# Altium schematic sheet My_STM32_BOARD_HEADER_SCH.SchDoc
size A4
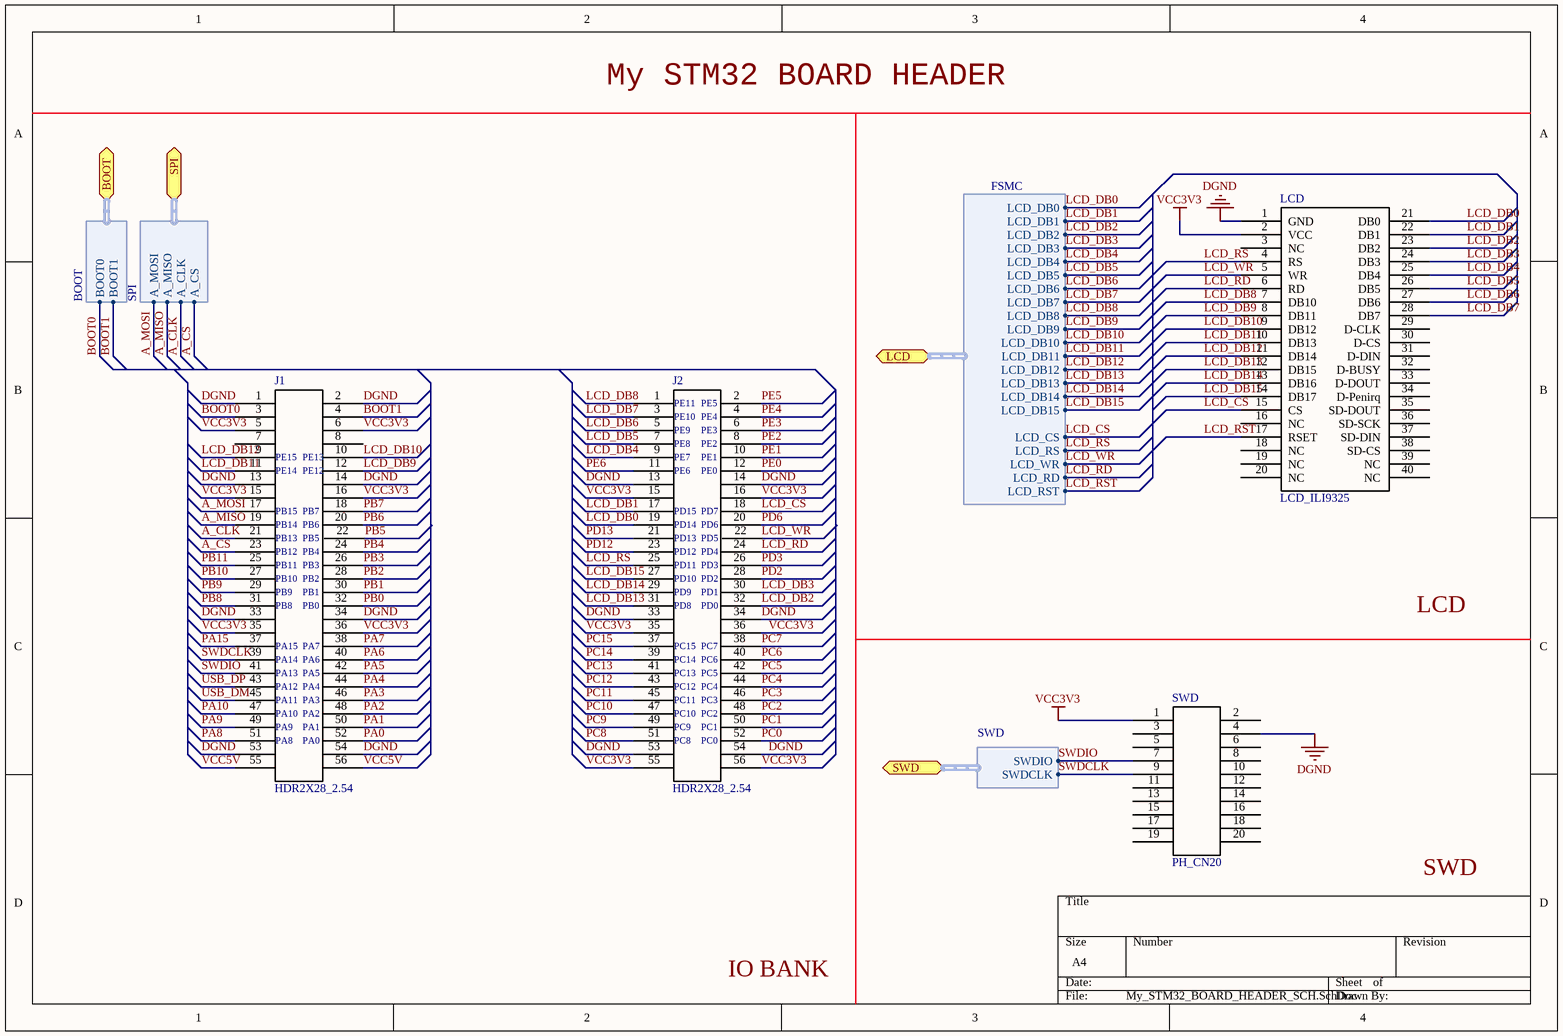
[diagram p0: My_STM32_BOARD_HEADER_SCH.SchDoc]

## Parts
J1  HDR2X28_2.54  [HDR2X28_2.54]
J2  HDR2X28_2.54  [HDR2X28_2.54]
LCD  LCD_ILI9325  [ILI9325]
SWD  PH_CN20  [CN20]

## Ports
BOOT (harness BOOT), LCD (harness FSMC), SPI (harness SPI), SWD (harness SWD)

## Harnesses
FSMC: LCD_RST, LCD_RD, LCD_WR, LCD_RS, LCD_CS, LCD_DB0, LCD_DB1, LCD_DB2, LCD_DB3, LCD_DB4, LCD_DB5, LCD_DB6, LCD_DB7, LCD_DB8, LCD_DB9, LCD_DB10, LCD_DB11, LCD_DB12, LCD_DB13, LCD_DB14, LCD_DB15
SWD: SWDIO, SWDCLK
BOOT: BOOT1, BOOT0
SPI: A_CLK, A_MISO, A_MOSI, A_CS

## Nets
DGND: J1.1 J1.2 J1.13 J1.14 J1.33 J1.34 J1.53 J1.54 J2.13 J2.14 J2.33 J2.34 J2.53 J2.54 LCD.1(GND) SWD.4
VCC3V3: J1.5 J1.6 J1.15 J1.16 J1.35 J1.36 J2.15 J2.16 J2.35 J2.36 J2.55 J2.56 LCD.2(VCC) SWD.1
A_CLK: J1.21 ; port SPI.A_CLK
A_CS: J1.23 ; port SPI.A_CS
A_MISO: J1.19 ; port SPI.A_MISO
A_MOSI: J1.17 ; port SPI.A_MOSI
BOOT0: J1.3 ; port BOOT.BOOT0
BOOT1: J1.4 ; port BOOT.BOOT1
LCD_CS: J2.18 LCD.15(CS) ; port LCD.LCD_CS
LCD_DB0: J2.19 LCD.21(DB0) ; port LCD.LCD_DB0
LCD_DB1: J2.17 LCD.22(DB1) ; port LCD.LCD_DB1
LCD_DB2: J2.32 LCD.23(DB2) ; port LCD.LCD_DB2
LCD_DB3: J2.30 LCD.24(DB3) ; port LCD.LCD_DB3
LCD_DB4: J2.9 LCD.25(DB4) ; port LCD.LCD_DB4
LCD_DB5: J2.7 LCD.26(DB5) ; port LCD.LCD_DB5
LCD_DB6: J2.5 LCD.27(DB6) ; port LCD.LCD_DB6
LCD_DB7: J2.3 LCD.28(DB7) ; port LCD.LCD_DB7
LCD_DB8: J2.1 LCD.7(DB10) ; port LCD.LCD_DB8
LCD_DB9: J1.12 LCD.8(DB11) ; port LCD.LCD_DB9
LCD_DB10: J1.10 LCD.9(DB12) ; port LCD.LCD_DB10
LCD_DB11: J1.11 LCD.10(DB13) ; port LCD.LCD_DB11
LCD_DB12: J1.9 LCD.11(DB14) ; port LCD.LCD_DB12
LCD_DB13: J2.31 LCD.12(DB15) ; port LCD.LCD_DB13
LCD_DB14: J2.29 LCD.13(DB16) ; port LCD.LCD_DB14
LCD_DB15: J2.27 LCD.14(DB17) ; port LCD.LCD_DB15
LCD_RD: J2.24 LCD.6(RD) ; port LCD.LCD_RD
LCD_RS: J2.25 LCD.4(RS) ; port LCD.LCD_RS
LCD_RST: LCD.17(RSET) ; port LCD.LCD_RST
LCD_WR: LCD.5(WR) ; port LCD.LCD_WR
PA0: J1.52
PA1: J1.50
PA2: J1.48
PA3: J1.46
PA4: J1.44
PA5: J1.42
PA6: J1.40
PA7: J1.38
PA8: J1.51
PA9: J1.49
PA10: J1.47
PA15: J1.37
PB0: J1.32
PB1: J1.30
PB2: J1.28
PB3: J1.26
PB4: J1.24
PB5: J1.22
PB6: J1.20
PB7: J1.18
PB8: J1.31
PB9: J1.29
PB10: J1.27
PB11: J1.25
PC0: J2.52
PC1: J2.50
PC2: J2.48
PC3: J2.46
PC4: J2.44
PC5: J2.42
PC6: J2.40
PC7: J2.38
PC8: J2.51
PC9: J2.49
PC10: J2.47
PC11: J2.45
PC12: J2.43
PC13: J2.41
PC14: J2.39
PC15: J2.37
PD2: J2.28
PD3: J2.26
PD6: J2.20
PD12: J2.23
PD13: J2.21
PE0: J2.12
PE1: J2.10
PE2: J2.8
PE3: J2.6
PE4: J2.4
PE5: J2.2
PE6: J2.11
SWDCLK: J1.39 SWD.9 ; port SWD.SWDCLK
SWDIO: J1.41 SWD.7 ; port SWD.SWDIO
USB_DM: J1.45
USB_DP: J1.43
VCC5V: J1.55 J1.56

Not connected (* = marked no-connect by the designer): J1 7 8; J2 22; LCD 3(NC) 16(NC) 18(NC) 19(NC) 20(NC) 29(D-CLK) 30(D-CS) 31(D-DIN) 32(D-BUSY) 33(D-DOUT) 34(D-Penirq) 35(SD-DOUT) 36(SD-SCK) 37(SD-DIN) 38(SD-CS) 39(NC) 40(NC); SWD 2 3 5 6 8 10 11 12 13 14 15 16 17 18 19 20

## Notes on the sheet
- My STM32 BOARD HEADER
- (near J2) PE8
- (near J2) PE9
- (near J2) PE10
- (near J2) PE11
- (near J2) PE2
- (near J2) PE3
- (near J2) PE4
- (near J2) PE5
- (near J1) PB15
- (near J1) PE14
- (near J1) PE15
- (near J1) PB7
- (near J1) PE12
- (near J1) PE13
- (near J2) PD15
- (near J2) PE6
- (near J2) PE7
- (near J2) PD7
- (near J2) PE0
- (near J2) PE1
- (near J1) PB10
- (near J1) PB11
- (near J1) PB12
- (near J1) PB13
- (near J1) PB14
- (near J1) PB2
- (near J1) PB3
- (near J1) PB4
- (near J1) PB5
- (near J1) PB6
- (near J2) PD10
- (near J2) PD11
- (near J2) PD12
- (near J2) PD13
- (near J2) PD14
- (near J2) PD2
- (near J2) PD3
- (near J2) PD4
- (near J2) PD5
- (near J2) PD6
- (near J1) PA15
- (near J1) PB8
- (near J1) PB9
- (near J1) PA7
- (near J1) PB0
- (near J1) PB1
- (near J2) PC15
- (near J2) PD8
- (near J2) PD9
- (near J2) PC7
- (near J2) PD0
- (near J2) PD1
- LCD
- (near J1) PA11
- (near J1) PA12
- (near J1) PA10
- (near J1) PA13
- (near J1) PA14
- (near J1) PA2
- (near J1) PA3
- (near J1) PA4
- (near J1) PA5
- (near J1) PA6
- (near J2) PC10
- (near J2) PC11
- (near J2) PC12
- (near J2) PC13
- (near J2) PC14
- (near J2) PC2
- (near J2) PC3
- (near J2) PC4
- (near J2) PC5
- (near J2) PC6
- (near J1) PA8
- (near J1) PA9
- (near J1) PA0
- (near J1) PA1
- (near J2) PC8
- (near J2) PC9
- (near J2) PC0
- (near J2) PC1
- SWD
- IO BANK
- Labels drawn without touching a wire or pin: LCD_WR

## Library data of the parts
LCD = LCD_ILI9325: LCD ILI9325
SWD = PH_CN20: 10 X 2